# Altium schematic sheet Digital_Inputs.SchDoc
size A4
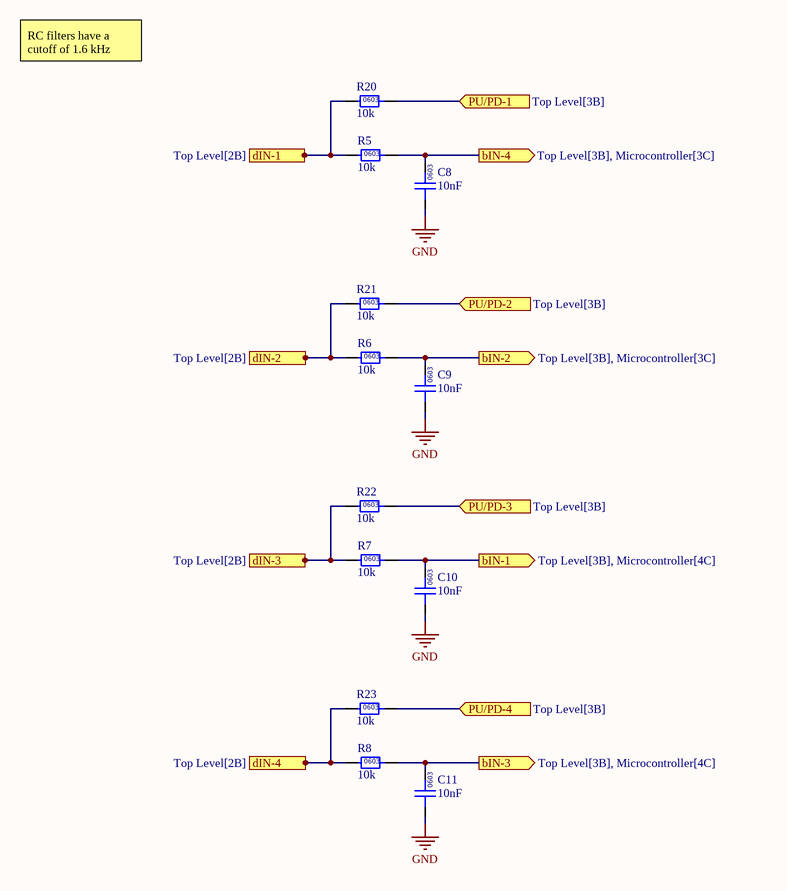
[diagram p0: Digital_Inputs.SchDoc]

## Parts
C8  10nF  [0603]
C9  10nF  [0603]
C10  10nF  [0603]
C11  10nF  [0603]
R5  10k  [0603]
R6  10k  [0603]
R7  10k  [0603]
R8  10k  [0603]
R20  10k  [0603]
R21  10k  [0603]
R22  10k  [0603]
R23  10k  [0603]

## Ports
bIN-1 (out, see Top Level[3B], Microcontroller[4C]), bIN-2 (out, see Top Level[3B], Microcontroller[3C]), bIN-3 (out, see Top Level[3B], Microcontroller[4C]), bIN-4 (out, see Top Level[3B], Microcontroller[3C]), dIN-1 (in, see Top Level[2B]), dIN-2 (in, see Top Level[2B]), dIN-3 (in, see Top Level[2B]), dIN-4 (in, see Top Level[2B]), PU/PD-1 (in, see Top Level[3B]), PU/PD-2 (in, see Top Level[3B]), PU/PD-3 (in, see Top Level[3B]), PU/PD-4 (in, see Top Level[3B])

## Nets
GND: C8.1 C9.1 C10.1 C11.1
bIN-1: C10.2 R7.2 ; port bIN-1
bIN-2: C9.2 R6.2 ; port bIN-2
bIN-3: C11.2 R8.2 ; port bIN-3
bIN-4: C8.2 R5.2 ; port bIN-4
dIN-1: R5.1 R20.1 ; port dIN-1
dIN-2: R6.1 R21.1 ; port dIN-2
dIN-3: R7.1 R22.1 ; port dIN-3
dIN-4: R8.1 R23.1 ; port dIN-4
PU/PD-1: R20.2 ; port PU/PD-1
PU/PD-2: R21.2 ; port PU/PD-2
PU/PD-3: R22.2 ; port PU/PD-3
PU/PD-4: R23.2 ; port PU/PD-4

## Notes on the sheet
- RC filters have a cutoff of 1.6 kHz
- (in symbol GCM188L81H103KA03D) 0603
- (in symbol RC0603FR-0710KL) 0603

## Library data of the parts
C8-C11 = GCM188L81H103KA03D: Manufacturer: muRata; Rated Voltage: 50V; Tolerance: ±10%; Material: MLCC; Temperature Rating: X8L; Part Number: GCM188L81H103KA03D; Value: 10nF; Digikey Part Number: 490-GCM188L81H103KA03DCT-ND
R5-R8 R20-R23 = RC0603FR-0710KL: Manufacturer: YAGEO; Tolerance: 0.01; Rated Power: 0.1W; Part Number: RC0603FR-0710KL; Value: 10k; Material: FR-07; Digikey Part Number: 311-10.0KHRCT-ND